# EAGLE design con_IMU (EAGLE 9.0.0)
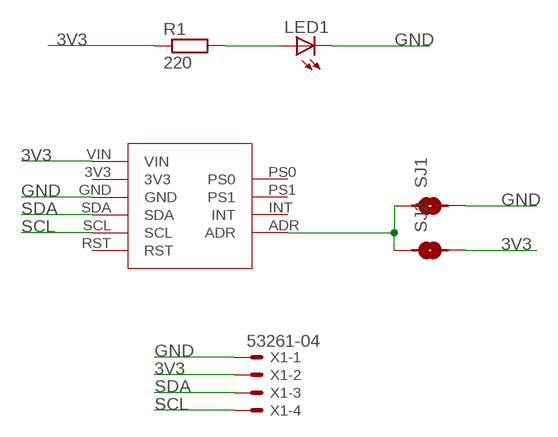
[diagram p0: schematic, sheet 1]

## Parts
LED1  LEDCHIPLED_1206  [CHIPLED_1206]
R1  220  RR1206  [R1206]
SJ1  SMD-JUMPER-2  [SMD-JUMPER-2]
SJ2  SMD-JUMPER-2  [SMD-JUMPER-2]
U$1  BNO055  [BNO055_MOD]
X1  53261-04  [53261-04]

## Nets
3V3: R1.1 SJ2.2 U$1.VIN X1.2
GND: LED1.C SJ1.2 U$1.GND X1.1
N$2: LED1.A R1.2
N$5: SJ1.1 SJ2.1 U$1.ADR
SCL: U$1.SCL X1.4
SDA: U$1.SDA X1.3
Unconnected: U$1.3V3 U$1.INT U$1.PS0 U$1.PS1 U$1.RST

## Library data of the parts
LED1 = led:LED: LED OSRAM: - CHIPLED LG R971, LG N971, LY N971, LG Q971, LY Q971, LO R971, LY R971 LH N974, LH R974 LS Q976, LO Q976, LY Q976 LO Q996 - Hyper CHIPLED LW Q18S LB Q993, LB Q99A, LB R99A - SideLED LS A670, LO A670, LY A670, LG A670, LP A670 LB A673, LV A673, LT A673, LW A673 LH A674 LY A675 LS A676, LA A676, LO A676, LY A676, LW A676 LS A679, LY A679, LG A679 - Hyper Micro SIDELED® LS Y876, LA Y876, LO Y876, LY Y876 LT Y87S - SmartLED LW L88C, LW L88S LB L89C, LB L89S, LG L890 LS L89K, LO L89K, LY L89K LS L896, LA L896, LO L896, LY L896 - TOPLED LS T670, LO T670, LY T670, LG T670, LP T670 LSG T670, LSP T670, LSY T670, LOP T670, LYG T670 LG T671, LOG T671, LSG T671 LB T673, LV T673, LT T673, LW T673 LH T674 LS T676, LA T676, LO T676, LY T676, LB T676, LH T676, LSB T676, LW T676 LB T67C, LV T67C, LT T67C, LS T67K, LO T67K, LY T67K, LW E67C LS E67B, LA E67B, LO E67B, LY E67B, LB E67C, LV E67C, LT E67C LW T67C LS T679, LY T679, LG T679 LS T770, LO T770, LY T770, LG T770, LP T770 LB T773, LV T773, LT T773, LW T773 LH T774 LS E675, LA E675, LY E675, LS T675 LS T776, LA T776, LO T776, LY T776, LB T776 LHGB T686 LT T68C, LB T68C - Hyper Mini TOPLED® LB M676 - Mini TOPLED Santana® LG M470 LS M47K, LO M47K, LY M47K Source: http://www.osram.convergy.de LUXEON: - LUMILED® LXK2-PW12-R00, LXK2-PW12-S00, LXK2-PW14-U00, LXK2-PW14-V00 LXK2-PM12-R00, LXK2-PM12-S00, LXK2-PM14-U00 LXK2-PE12-Q00, LXK2-PE12-R00, LXK2-PE12-S00, LXK2-PE14-T00, LXK2-PE14-U00 LXK2-PB12-K00, LXK2-PB12-L00, LXK2-PB12-M00, LXK2-PB14-N00, LXK2-PB14-P00, LXK2-PB14-Q00 LXK2-PR12-L00, LXK2-PR12-M00, LXK2-PR14-Q00, LXK2-PR14-R00 LXK2-PD12-Q00, LXK2-PD12-R00, LXK2-PD12-S00 LXK2-PH12-R00, LXK2-PH12-S00 LXK2-PL12-P00, LXK2-PL12-Q00, LXK2-PL12-R00 Source: www.luxeon.com KINGBRIGHT: KA-3528ASYC Source: www.kingbright.com
R1 = eagle-ltspice:R: RESISTOR, European symbol; SPICEMODEL: NONE; SPICEPREFIX: R
SJ1 SJ2 = FaBo-etc:SMD-JUMPER-2
U$1 = BNO055:BNO055
X1 = con-molex:53?-04: CONNECTOR wire to board 1.25 mm (.049 inch) pitch header; MF: MOLEX; OC_FARNELL: 1125374; OC_NEWARK: unknown

## Board
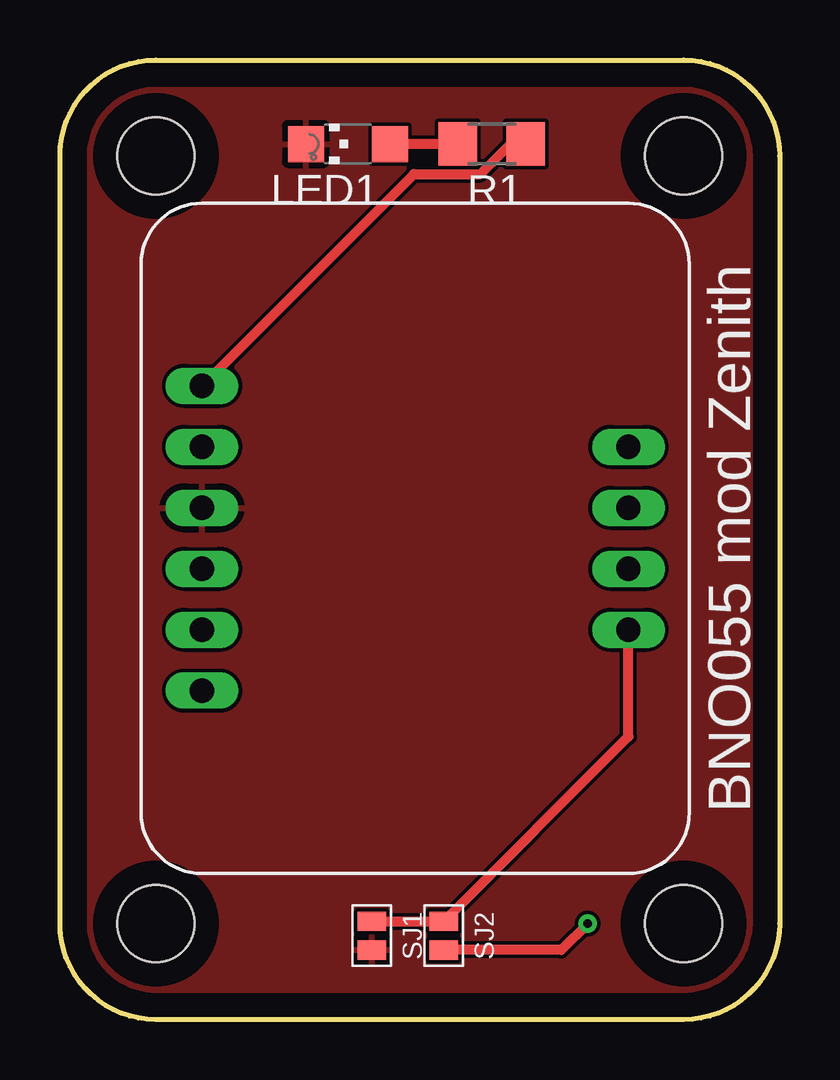
[diagram p1: board, top side]
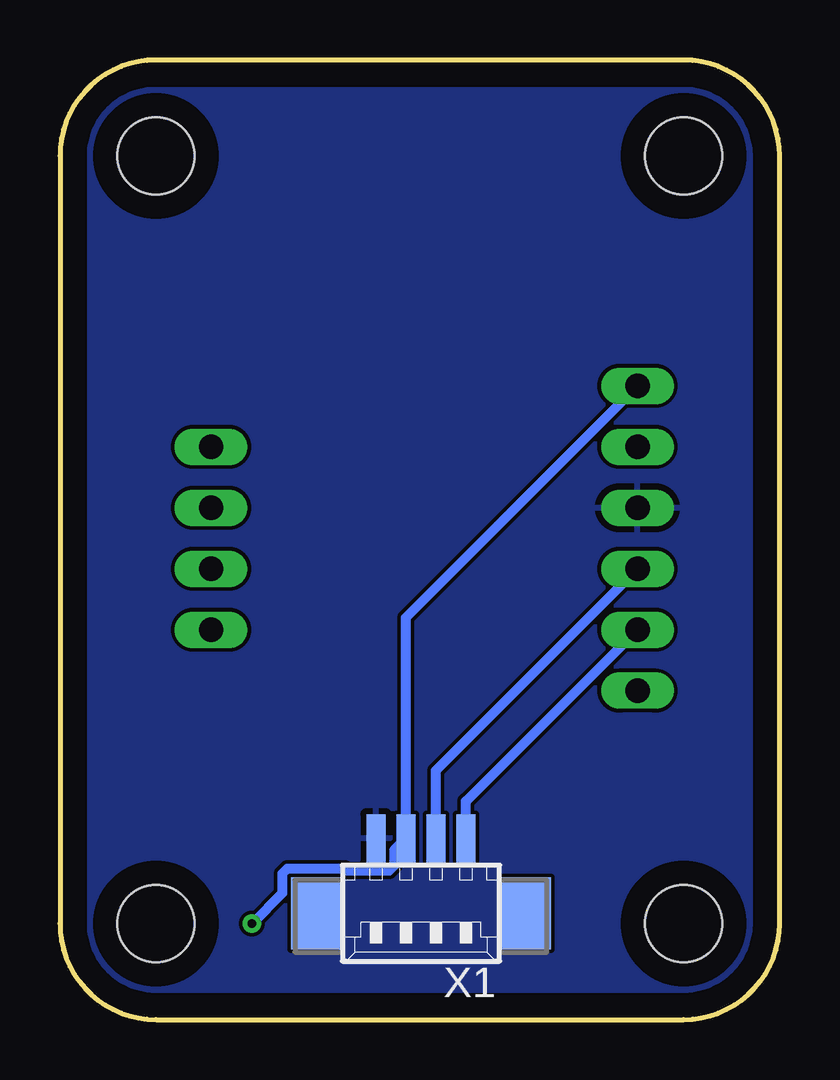
[diagram p2: board, bottom side, seen from below]

Size 30 x 40 mm. Coordinates in mm from the lower left corner, seen from the top.
Outline: 26,0 4,0 arc-90 0,4 0,36 arc-90 4,40 26,40 arc-90 30,36 30,4 arc-90 26,0
Copper layers (1*16): Top 0.035mm / dielectric 1.5mm / Bottom 0.035mm
Design rules "default": minimum track width 6mil, minimum drill 0.35mm, track to track 6mil, track to pad 6mil, pad to pad 6mil, via to via 6mil, smd to smd 6mil, copper to edge 40mil, drill to drill 6mil, minimum pad ring 10mil, minimum via ring 8mil, stop-mask expansion 4mil, vias tented up to drill 0mil, thermal gap 10mil
Holes 3.2 mm at 4,4 4,36 26,4 26,36

### Footprints (pad centres in the part's own frame; a part is rotated, then mirrored left to right if it is on the bottom)
CHIPLED_1206 = smd 1.5 x 1.5: A 0,-1.75; C 0,1.75
R1206 = smd 1.6 x 1.803: 1 -1.422,0; 2 1.422,0
SMD-JUMPER-2 = smd 0.8 x 1.2: 1 -0.6,0; 2 0.6,0
BNO055_MOD = drill 1.016 long: 3V3 -12.7,5.08; ADR 5.08,-2.54; GND -12.7,2.54; INT 5.08,0; PS0 5.08,5.08; PS1 5.08,2.54; RST -12.7,-5.08; SCL -12.7,-2.54; SDA -12.7,0; VIN -12.7,7.62
53261-04 = smd 0.8 x 2: 1 1.875,-2.5; 2 0.625,-2.5; 3 -0.625,-2.5; 4 -1.875,-2.5 | smd 2.1 x 3: S1 4.375,0.625; S2 -4.375,0.625

### Placement (x,y rotation side)
LED1  12,36.5 90 top
R1  18,36.5 180 top
SJ1  13,3.5 270 top
SJ2  16,3.5 270 top
U$1  18.62,18.79 0 top
X1  14.95,5.06 180 bottom

### Tracks (layer width: path | path; a pad name or v marks a point on that pad's centre or on a via)
3V3  (via drill 0.35)
  Top 0.406: v22,4 20.9,2.9 SJ2.2 | U$1.VIN 14.75,35.24 17.52,35.24 18.78,36.5 R1.1
  Bottom 0.406: U$1.VIN 15.57,16.75 X1.2 16.07,7.07 16.07,6.41 16.28,6.2 18.04,6.2 18.13,6.29 20.52,6.29 20.73,6.08 20.73,5.27 v22,4
GND
  pour Top: 26,0 4,0 arc-90 0,4 0,36 arc-90 4,40 26,40 arc-90 30,36 30,4 arc-90
  pour Bottom: 26,0 4,0 arc-90 0,4 0,36 arc-90 4,40 26,40 arc-90 30,36 30,4 arc-90
N$2
  Top 0.406: R1.2 LED1.A
N$5
  Top 0.406: SJ1.1 SJ2.1 23.7,11.8 U$1.ADR
SCL
  Bottom 0.406: X1.4 13.07,9.1 U$1.SCL
SDA
  Bottom 0.406: X1.3 14.32,10.38 U$1.SDA